# EasyEDA Pro project ProPrj_HPMDuino_DEV_2025-07-16.epro, board PCB2
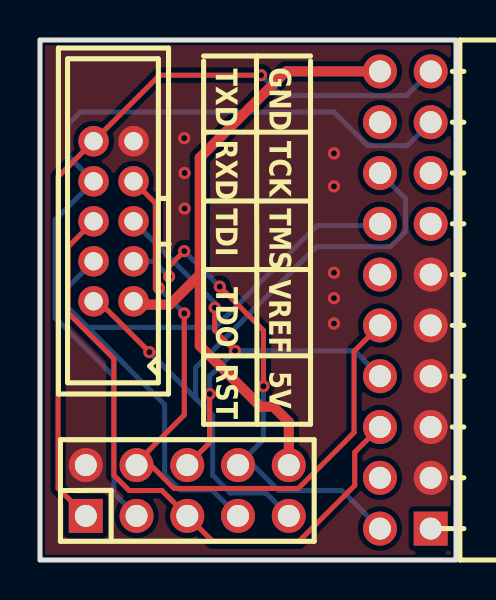
[diagram p4: board, top side]
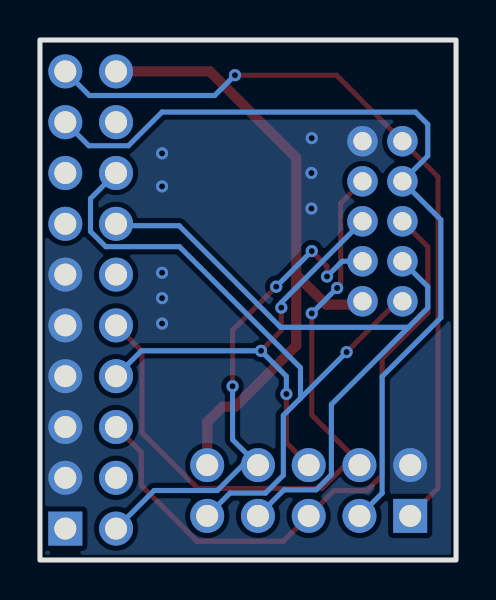
[diagram p5: board, bottom side, seen from below]

Outline 20.83 x 26 mm; copper layers: Top Layer, Bottom Layer. Coordinates in mm from the lower left corner of the outline.
Outline path: rectangle 0,26 20.83,0
Stack: Top Layer 0.035mm / Dielectric1 1.51mm FR4 er 4.5 / Bottom Layer 0.035mm

## Design rules (mm)
template: 自定义配置
spacing copperThickness1oz (default): track to track 0.102, other pairs 0.152 to 0.3
spacing copperThickness2oz: track to track 0.203, other pairs 0.152 to 0.3
track width copperThickness1oz (default): min 0.127, default 0.254, max 2.54
track width copperThickness2oz: min 0.203, default 0.254, max 2.54
differential pair differentialPair (default): width min 0.127, default 0.254, max 2.54; gap min 0.152, default 0.152
via viaSize (default): diameter min 0.5, default 0.61, max 10; hole min 0.3, default 0.305, max 6.3
net GND uses copperRegion1

## Placement (name value [footprint] x y rotation side)
H1  -  [HDR-TH_10P-P2.54-V-M-R2-C5-S2.54]  7.38 3.48 0 top
P1  2.0-2*5P直简牛  [IDC-TH_10P-P2.00-V-R2-C5-S2.00]  3.68 16.94 90 top
U2  PM254-2-10-W-8.5  [HDR-TH_20P-P2.54-H-F-R2-C10-W8.5]  18.29 13 90 top

## Footprints (pads in the part's own frame, mm; a bottom-side part is the same pattern mirrored in y, then rotated)
HDR-TH_10P-P2.54-V-M-R2-C5-S2.54
  rect 1.7x1.7 hole 1.1: 1(-5.08,-1.27)
  round 1.7 hole 1.1: 2(-5.08,1.27) 3(-2.54,-1.27) 4(-2.54,1.27) 5(0,-1.27) 6(0,1.27) 7(2.54,-1.27) 8(2.54,1.27) 9(5.08,-1.27) 10(5.08,1.27)
HDR-TH_20P-P2.54-H-F-R2-C10-W8.5
  rect 1.7x1.7 hole 1.1: 1(-11.43,-1.27)
  round 1.7 hole 1.1: 2(-11.43,1.27) 3(-8.89,-1.27) 4(-8.89,1.27) 5(-6.35,-1.27) 6(-6.35,1.27) 7(-3.81,-1.27) 8(-3.81,1.27) 9(-1.27,-1.27) 10(-1.27,1.27) 11(1.27,-1.27) 12(1.27,1.27) 13(3.81,-1.27) 14(3.81,1.27) 15(6.35,-1.27) 16(6.35,1.27) 17(8.89,-1.27) 18(8.89,1.27) 19(11.43,-1.27) 20(11.43,1.27)
IDC-TH_10P-P2.00-V-R2-C5-S2.00
  round 1.524 hole 0.914: 1(-4.002,-1) 2(-4.002,1) 3(-2.001,-1) 4(-2.001,1) 5(-0.002,-1) 6(-0.002,1) 7(1.998,-1) 8(1.998,1) 9(4.002,-1) 10(4.002,1)

## Nets
As in the schematic.

Pads without a net: U2 4 12 13 15 18

## Via types
v1: diameter 0.61, hole 0.305, Top Layer to Bottom Layer, 19 vias

## Routing (per net, layer and track width the routed paths; a pad name or vN(x,y) marks a point on that pad's centre or on a via; arc(x,y) is an arc through that point)
+5V: length 32.4
  Top Layer w0.508: U2.20 12.32,24.43 8,20.11 8,14.27 ; P1.1 4.85,12.77 6.5,12.77 8,14.27 ; 8,14.27 8,10.71 11.05,7.67 11.68,7.67 12.45,6.9 H1.10
GND:
  vias: v1(7.22,21.09) v1(7.24,19.35) v1(7.24,17.57) v1(14.72,20.33) v1(14.72,18.68) v1(14.72,14.36) v1(14.72,13.09) v1(14.72,11.82)
_JTAG_TCK: length 34.6
  Top Layer w0.254: v1(5.95,13.6) 5.77,13.78 5.77,17.84 P1.7 ; U2.10 15.72,10.43 15.72,6.37 12.93,3.58 6.71,3.58 5.44,4.85 4.94,4.85 ; 4.94,4.85 H1.4 ; 4.94,4.85 4.94,4.96 7.22,7.25 v1(7.22,12.33)
  Bottom Layer w0.254: v1(5.95,13.6) v1(7.22,12.33)
_JTAG_TDI: length 32.2
  Top Layer w0.254: U2.6 15.76,5.39 15.76,3.73 12.96,0.94 8.64,0.94 H1.5 6.11,3.47 4.46,3.47 3.7,4.24 3.7,10.06 1.41,12.35 1.41,15.67 P1.6
_JTAG_TDO: length 34.5
  Bottom Layer w0.254: U2.14 16.92,16.72 13.86,16.72 8.78,11.64 2.38,11.64 ; 2.38,11.64 1.41,12.6 1.41,13.67 P1.4 ; 2.38,11.64 6.24,7.78 6.24,4.27 7,3.51 8.61,3.51 H1.7
_JTAG_TMS: length 23.1
  Top Layer w0.254: v1(9.76,10.46) 8.75,11.47 v1(8.75,12.62) ; v1(8.49,8.3) 8.49,5.86 H1.6
  Bottom Layer w0.254: P1.5 8.75,12.87 v1(8.75,12.62) ; v1(8.49,8.3) 8.49,9.19 v1(9.76,10.46) 15.75,10.46 U2.8
JTAG_VREF: length 25
  Top Layer w0.254: v1(7.22,15.45) 6.46,14.68 v1(6.46,14.18) ; v1(11.19,8.69) 11.19,11.48 v1(9,13.67)
  Bottom Layer w0.254: P1.3 5.7,14.94 v1(6.46,14.18) ; U2.2 15.11,3.48 11.95,3.48 10.68,4.75 H1.8 11.19,6.02 v1(11.19,8.69) ; v1(7.22,15.45) v1(9,13.67)
RSTN: length 34.3
  Top Layer w0.254: v1(5.48,10.4) 2.94,12.94 P1.2
  Bottom Layer w0.254: U2.16 18.3,18.07 18.3,16.43 17.53,15.67 13.84,15.67 7.79,9.61 7.79,8.09 ; 7.79,8.09 8.64,7.23 8.64,4.24 9.53,3.35 11.31,3.35 H1.9 ; 7.79,8.09 v1(5.48,10.4)
UART0_RX: length 42.2
  Bottom Layer w0.254: H1.3 3.7,3.34 3.7,9.17 0.76,12.11 0.76,17.01 P1.8 1.41,20.2 1.41,21.78 2.03,22.4 14.71,22.4 16.4,20.71 18.38,20.71 U2.17
UART0_TX: length 39.2
  Top Layer w0.254: H1.1 0.91,3.59 0.91,19.16 P1.10 5.99,24.24 v1(11.07,24.24)
  Bottom Layer w0.254: U2.19 18.35,23.23 12.08,23.23 v1(11.07,24.24)

## Copper pours and planes (outline as drawn; the poured copper is in the pictures)
GND on Top Layer: -0.76,26.46 21.21,26.46 21.21,-1.1 -0.76,-1.1
GND on Bottom Layer: -0.76,26.59 21.21,26.59 21.21,-0.97 -0.76,-0.97

## Text on the board
Top Silkscreen Layer: TDI | TDO | RST | VREF | TMS | 5V | RXD | TCK | TXD | GND
